# Altium schematic sheet Faceball_2000_buffered_adapter_v1.0.SchDoc
size A4; SheetNumber: 1; SheetTotal: 1
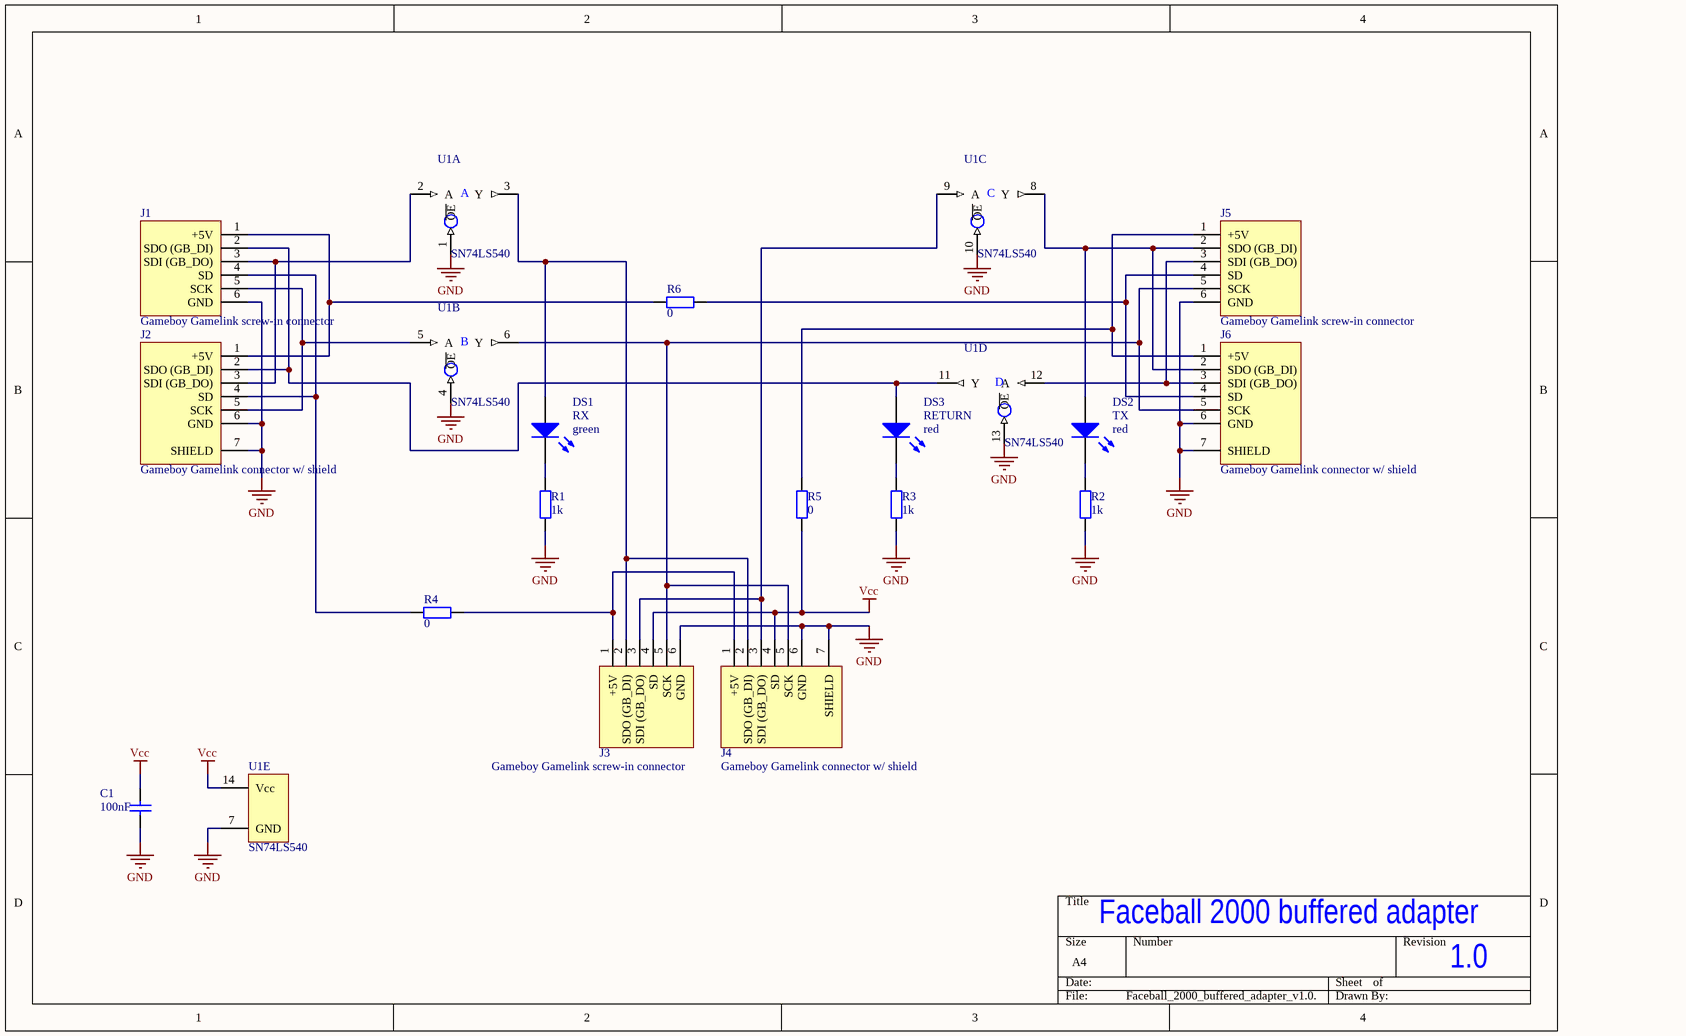
[diagram p0: Faceball_2000_buffered_adapter_v1.0.SchDoc]

## Parts
C1  value 100nF  [CAPC1608N-0603]  (hidden comment: Cap Unpol)
DS1  Purpose: RX  Color: green  [CD2012-0805]  (hidden comment: LED)
DS2  Purpose: TX  Color: red  [CD2012-0805]  (hidden comment: LED)
DS3  Purpose: RETURN  Color: red  [CD2012-0805]  (hidden comment: LED)
J1  Gameboy Gamelink screw-in connector  [Gameboy generic Gamelink connector]  (no BOM)
J2  Gameboy Gamelink connector w/ shield  [Gameboy Advance Gamelink connector 2]  (no BOM)
J3  Gameboy Gamelink screw-in connector  [Gameboy generic Gamelink connector]  (no BOM)
J4  Gameboy Gamelink connector w/ shield  [Gameboy Advance Gamelink connector 2]  (no BOM)
J5  Gameboy Gamelink screw-in connector  [Gameboy generic Gamelink connector]  (no BOM)
J6  Gameboy Gamelink connector w/ shield  [Gameboy Advance Gamelink connector 2]  (no BOM)
R1  value 1k  [RESC1608N-0603]  (hidden comment: Resistor)
R2  value 1k  [RESC1608N-0603]  (hidden comment: Resistor)
R3  value 1k  [RESC1608N-0603]  (hidden comment: Resistor)
R4  value 0  [RESC1608N-0603]  (hidden comment: Resistor)
R5  value 0  [RESC1608N-0603]  (hidden comment: Resistor)
R6  value 0  [RESC1608N-0603]  (hidden comment: Resistor)
U1  SN74LS540  [FP-D0014A-MFG]  (parts A,B,C,D,E of 5)

## Nets
GND: C1.1 J1.6(GND) J2.6(GND) J2.7(SHIELD) J3.6(GND) J4.6(GND) J4.7(SHIELD) J5.6(GND) J6.6(GND) J6.7(SHIELD) R1.2 R2.2 R3.2 U1.1(~{OE}) U1.4(~{OE}) U1.7(GND) U1.10(~{OE}) U1.13(~{OE})
Vcc: C1.2 J3.4(SD) J4.4(SD) R5.1 U1.14(Vcc)
NetDS1_1: DS1.1(A) J3.2(SDO_(GB_DI)) J4.2(SDO_(GB_DI)) U1.3(Y)
NetDS1_2: DS1.2(K) R1.1
NetDS2_1: DS2.1(A) J5.2(SDO_(GB_DI)) J6.2(SDO_(GB_DI)) U1.8(Y)
NetDS2_2: DS2.2(K) R2.1
NetDS3_1: DS3.1(A) J1.2(SDO_(GB_DI)) J2.2(SDO_(GB_DI)) U1.11(Y)
NetDS3_2: DS3.2(K) R3.1
NetJ1_1: J1.1(+5V) J2.1(+5V) R6.2
NetJ1_3: J1.3(SDI_(GB_DO)) J2.3(SDI_(GB_DO)) U1.2(A)
NetJ1_4: J1.4(SD) J2.4(SD) R4.1
NetJ1_5: J1.5(SCK) J2.5(SCK) U1.5(A)
NetJ3_1: J3.1(+5V) J4.1(+5V) R4.2
NetJ3_3: J3.3(SDI_(GB_DO)) J4.3(SDI_(GB_DO)) U1.9(A)
NetJ3_5: J3.5(SCK) J4.5(SCK) J5.5(SCK) J6.5(SCK) U1.6(Y)
NetJ5_1: J5.1(+5V) J6.1(+5V) R5.2
NetJ5_3: J5.3(SDI_(GB_DO)) J6.3(SDI_(GB_DO)) U1.12(A)
NetJ5_4: J5.4(SD) J6.4(SD) R6.1

## Notes on the sheet
- Faceball 2000 buffered adapter
- 1.0
- (in symbol SN74HC125DR, part B) B
- (in symbol SN74HC125DR, part C) C
- (in symbol SN74HC125DR, part D) D

## Library data of the parts
C1 = Cap Unpol: Capacitor; Manufacturer: Generic Components; Class I: Passive; Published: 8-Jun-2000; Revision: July-2002: Re-released for DXP Platform.; Publisher: Altium Limited; Class II: Capacitor
DS1-DS3 = LED red: Typical LED red; Manufacturer: Generic Components; Class I: Optoelectronic; Published: 8-Jun-2000; Revision: July-2002: Re-released for DXP Platform.; Publisher: Altium Limited; Class II: LED
J1 J3 J5 = Gameboy Gamelink screw-in connector: Gameboy Gamelink connector
J2 J4 J6 = Gameboy Gamelink connector w/ shield: Gameboy Gamelink connector
U1 = SN74HC125DR: IC BUFFER NON-INVERT 6V 14SOIC; Manufacturer: Texas Instruments; Manufacturer Part Number: SN74LS540N; Supplier 1: Mouser; Supplier Part Number 1: 595-SN74LS540N; RoHS: Yes; Category: Buffers, Drivers and Transceivers; Stock 1: 1472; Pricing 1: 1=2.21, 10=1.59, 50=1.59, 100=1.14, 1000=1.01, 10000=0.855 (USD); ComponentLink1URL: https://datasheet.ciiva.com/14133/mr645748-e-14133733.pdf?src-supplier=Distrelec; ComponentLink1Description: https://datasheet.ciiva.com/14133/mr645748-e-14133733.pdf?src-supplier=Distrelec; ComponentLink2URL: https://datasheet.ciiva.com/41456/001016983-da-01-en-ic-inv-8in-sn74ls-sn74ls540n-pdip-20-tid-41456327.pdf?src-supplier=Conrad; ComponentLink2Description: https://datasheet.ciiva.com/41456/001016983-da-01-en-ic-inv-8in-sn74ls-sn74ls540n-pdip-20-tid-41456327.pdf?src-supplier=Conrad; ComponentLink3URL: https://datasheet.ciiva.com/1869/sn74ls540-1869866.pdf?src-supplier=Digikey; ComponentLink3Description: https://datasheet.ciiva.com/1869/sn74ls540-1869866.pdf?src-supplier=Digikey
R1-R6 = Resistor: Published: 8-Jun-2000; LatestRevisionDate: 17-Jul-2002; LatestRevisionNote: Re-released for DXP Platform.; Publisher: Altium Limited